# EAGLE design ODB2 (EAGLE 9.2.2)
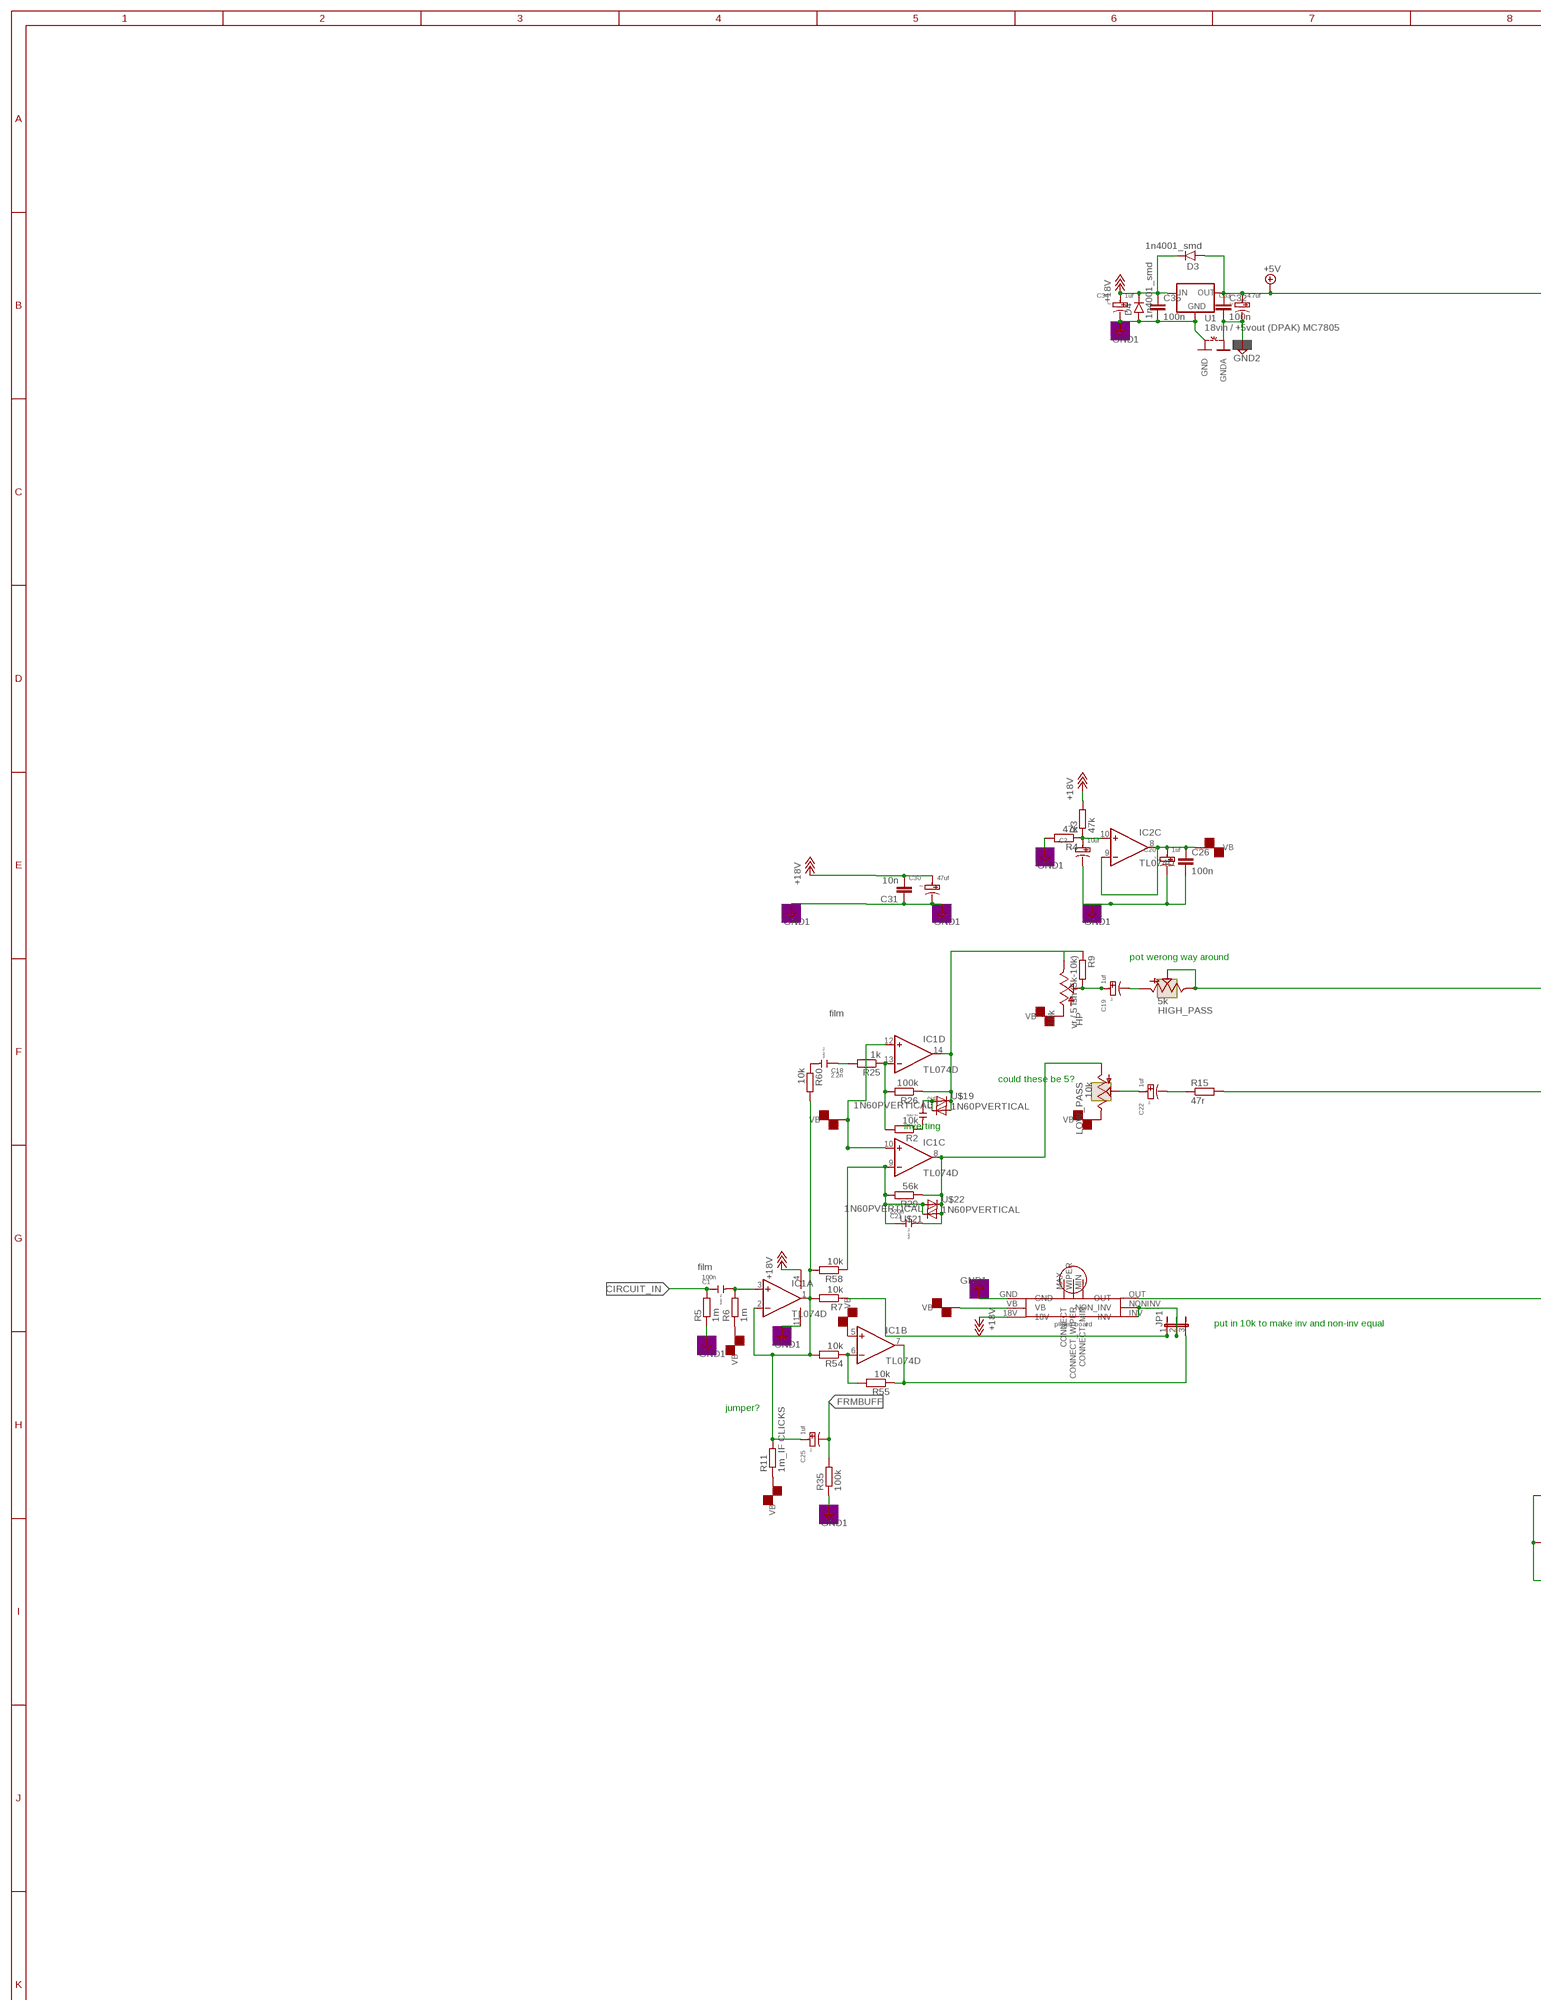
[diagram p0: schematic, sheet 1, part 1 of 3]
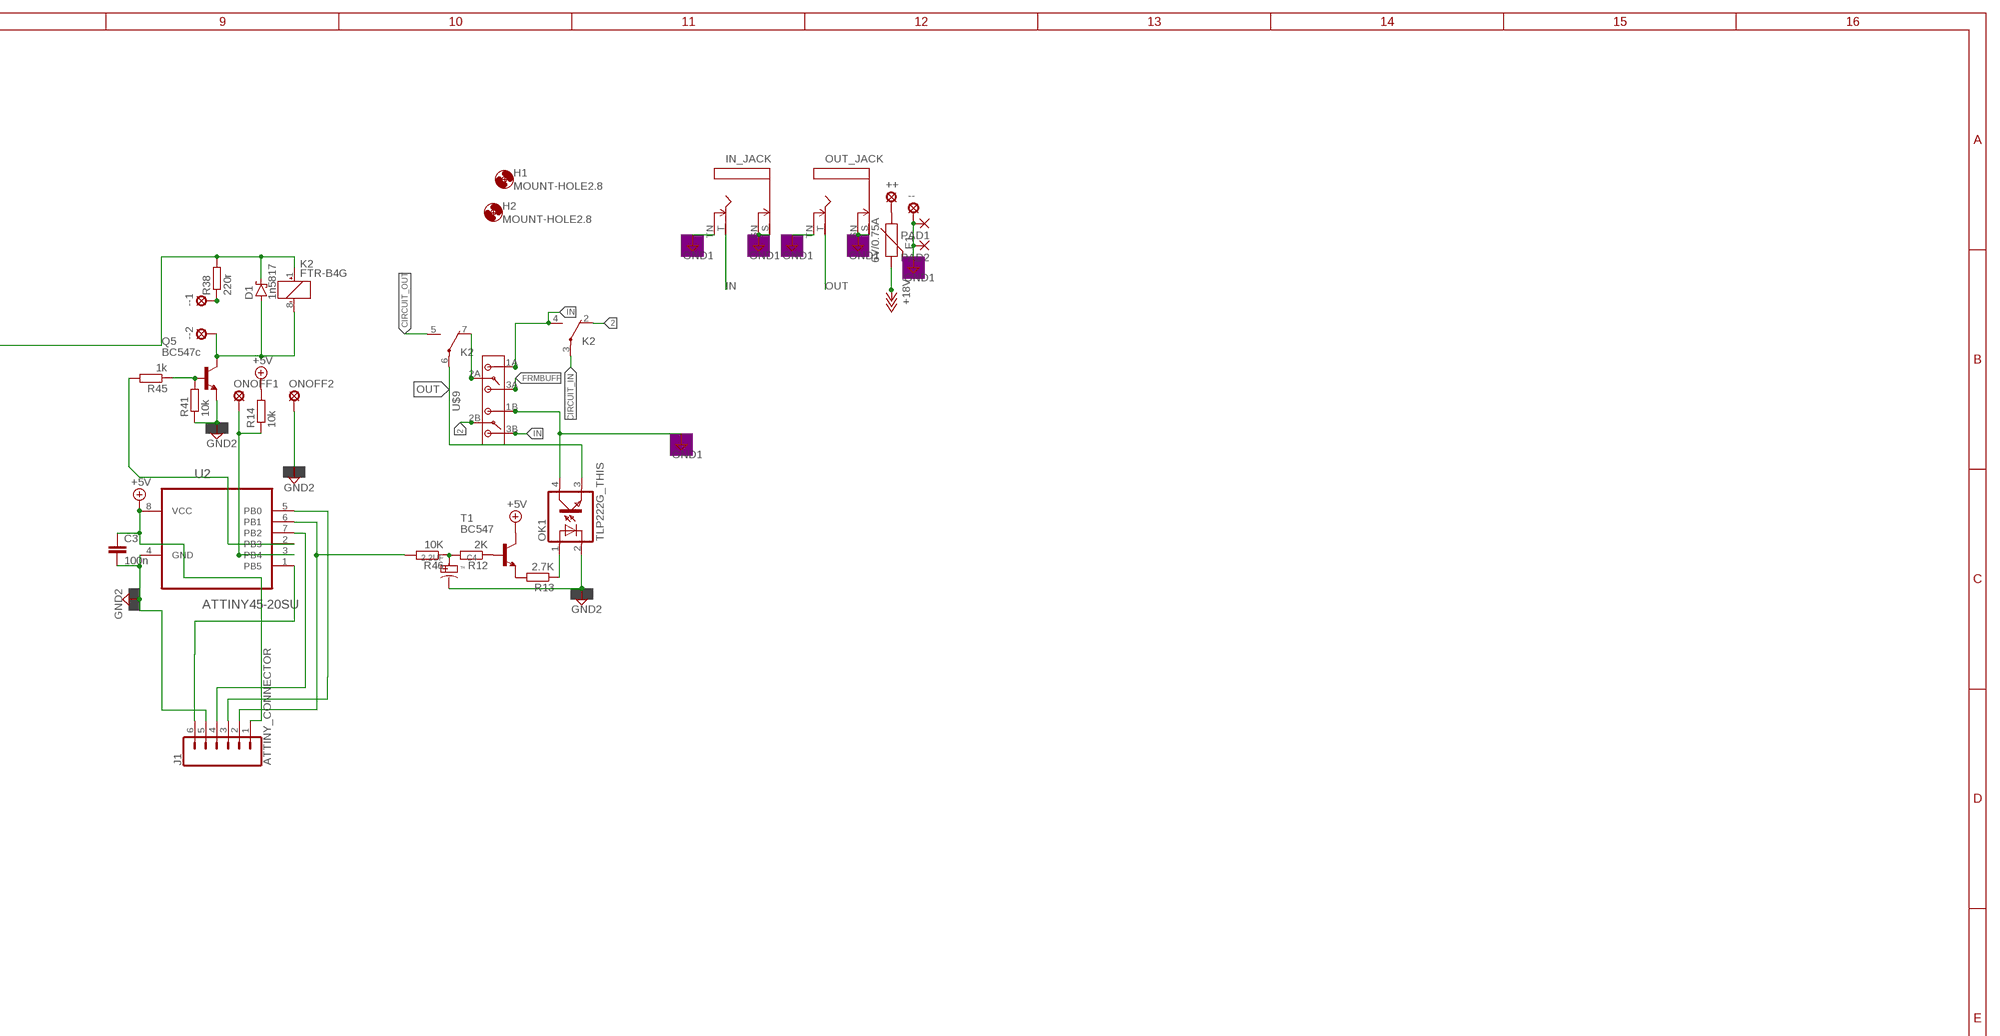
[diagram p1: schematic, sheet 1, part 2 of 3]
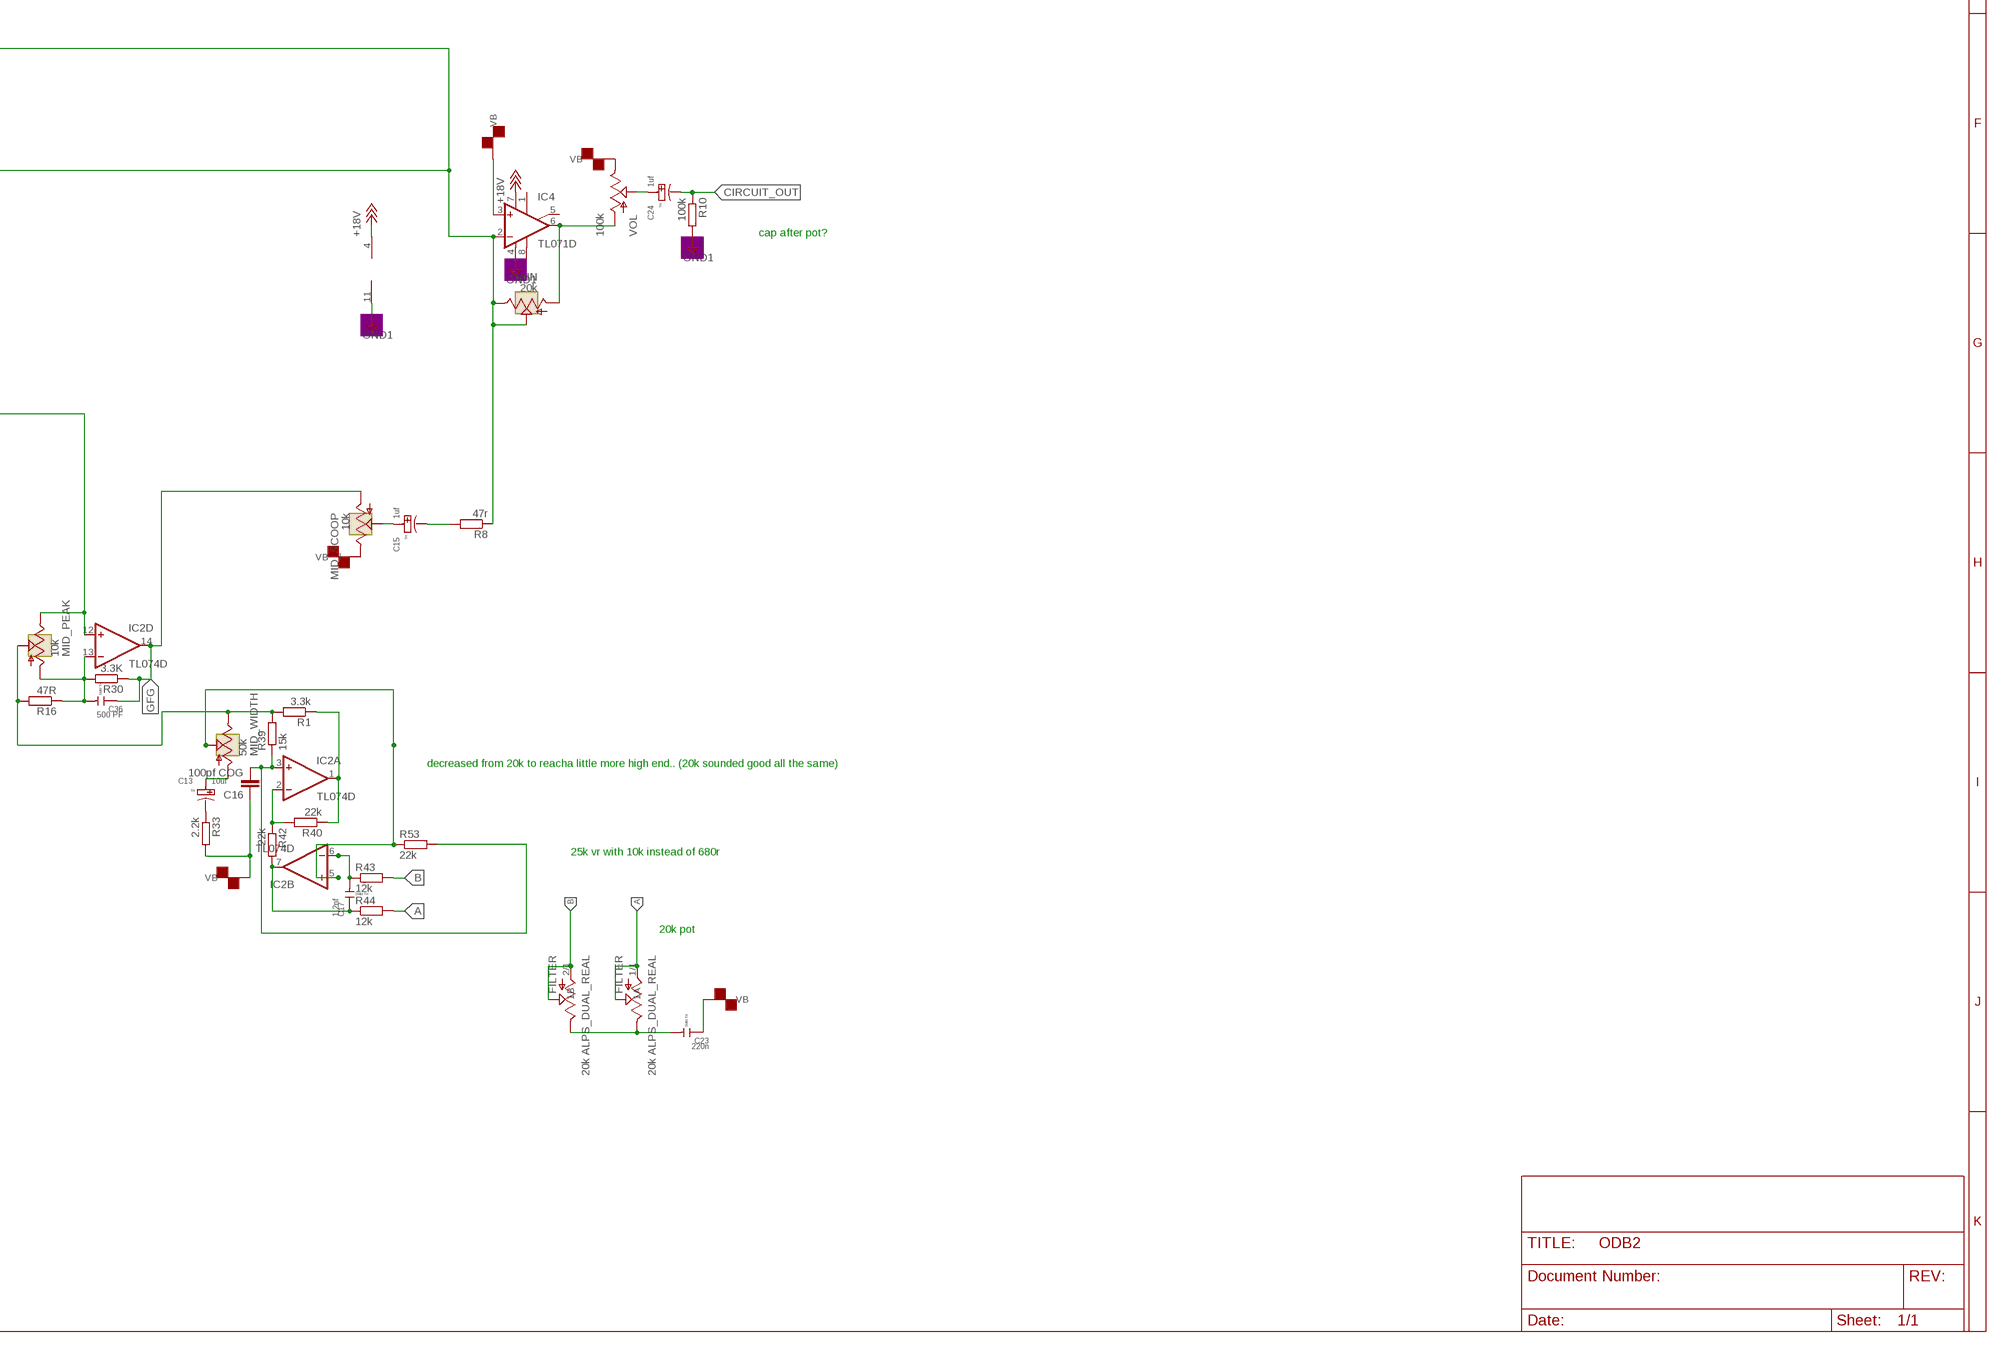
[diagram p2: schematic, sheet 1, part 3 of 3]

## Parts
++  LSP10  [LSP10]
--  LSP10  [LSP10]
--1  LSP10  [LSP10]
--2  LSP10  [LSP10]
C1  100n  THRU_HOLE_5MM_SPACING  [CERAMIC-5MM]
C2  10uf  THRU-HOLE-POLARIZED  [PC-D5.3MM]
C3  100n  C-EUC1206  [C1206]
C4  2.2UF  THRU-HOLE-POLARIZED  [PC-D5.3MM]
C12  1n  THRU_HOLE_5MM_SPACING  [CERAMIC-5MM]
C13  10uf  THRU-HOLE-POLARIZED  [PC-D5.3MM]
C15  1uf  THRU-HOLE-POLARIZED  [PC-D5.3MM]
C16  100pf COG  C-EUC1206  [C1206]
C17  1.2nf  THRU_HOLE_5MM_SPACING  [CERAMIC-5MM]
C18  2.2n  THRU_HOLE_5MM_SPACING  [CERAMIC-5MM]
C19  1uf  THRU-HOLE-POLARIZED  [PC-D5.3MM]
C20  1uf  THRU-HOLE-POLARIZED  [PC-D5.3MM]
C21  220n  THRU_HOLE_5MM_SPACING  [CERAMIC-5MM]
C22  1uf  THRU-HOLE-POLARIZED  [PC-D5.3MM]
C23  220n  THRU_HOLE_5MM_SPACING  [CERAMIC-5MM]
C24  1uf  THRU-HOLE-POLARIZED  [PC-D5.3MM]
C25  1uf  THRU-HOLE-POLARIZED  [PC-D5.3MM]
C26  100n  C-EUC1206  [C1206]
C30  47uf  THRU-HOLE-POLARIZED  [PC-D5.3MM]
C31  10n  C-EUC1206  [C1206]
C32  100n  C-EUC1206  [C1206]
C33  4.7uf  THRU-HOLE-POLARIZED  [PC-D5.3MM]
C34  1uf  THRU-HOLE-POLARIZED  [PC-D5.3MM]
C35  100n  C-EUC1206  [C1206]
C36  500 PF  THRU_HOLE_5MM_SPACING  [CERAMIC-5MM]
D1  1n5817  SCHOTTKY-DIODESMD  [SMB]
D3  1n4001_smd  1N400X.1  [DO41-1]
D4  1n4001_smd  1N400X.1  [DO41-1]
F1  6V/0.75A  PPTC_THREE-QUARTER-AMP  [1206]
FILTER  20k ALPS_DUAL_REAL  ALPS_DUAL_REAL  [ALPS_QUAD]
GAIN  20k  TRIM_US-3223G  [3223G]
H1  MOUNT-HOLE2.8  [2,8]
H2  MOUNT-HOLE2.8  [2,8]
HIGH_PASS  5k  TRIM_US-3223G  [3223G]
HP  10k  POT  [ALPS_POT]
IC1  TL074D  [SO14]
IC2  TL074D  [SO14]
IC4  TL071D  [SO08]
IN_JACK  MMMONNNNOHOLES  [MONONOHOLES]
J1  ATTINY_CONNECTOR  CONN_06LONGPADS  [1X06_LONGPADS]
JP1  JP2W  [JP2W]
K2  FTR-B4G  [FTR-B4G]
LOW_PASS  10k  TRIM_US-3223G  [3223G]
MID_PEAK  10k  TRIM_US-3223G  [3223G]
MID_SCOOP  10k  TRIM_US-3223G  [3223G]
MID_WIDTH  50k  TRIM_US-3223G  [3223G]
OK1  TLP222G_THIS  [DIL04]
ONOFF1  LSP10  [LSP10]
ONOFF2  LSP10  [LSP10]
OUT_JACK  MMMONNNNOHOLES  [MONONOHOLES]
PAD1  SMD5  [SMD2,54-5,08]
PAD2  SMD5  [SMD2,54-5,08]
Q5  BC547c  BC547  [TO92]
R1  3.3k  R-EU_R1206  [R1206]
R2  10k  R-EU_R1206  [R1206]
R3  47k  R-EU_R1206  [R1206]
R4  47k  R-EU_R1206  [R1206]
R5  1m  R-EU_R1206  [R1206]
R6  1m  R-EU_R1206  [R1206]
R7  10k  R-EU_R1206  [R1206]
R8  47r  R-EU_R1206  [R1206]
R9  vr / 5 ish (5k-10k)  R-EU_R1206  [R1206]
R10  100k  R-EU_R1206  [R1206]
R11  1m_IF CLICKS  R-EU_R1206  [R1206]
R12  2K  R-EU_M1206  [M1206]
R13  2.7K  R-EU_M1206  [M1206]
R14  10k  R-EU_M1206  [M1206]
R15  47r  R-EU_R1206  [R1206]
R16  47R  R-EU_R1206  [R1206]
R25  1k  R-EU_R1206  [R1206]
R26  100k  R-EU_R1206  [R1206]
R29  56k  R-EU_R1206  [R1206]
R30  3.3K  R-EU_R1206  [R1206]
R33  2.2k  R-EU_R1206  [R1206]
R35  100k  R-EU_R1206  [R1206]
R38  220r  R-EU_M1206  [M1206]
R39  15k  R-EU_R1206  [R1206]
R40  22k  R-EU_R1206  [R1206]
R41  10k  R-EU_M1206  [M1206]
R42  22k  R-EU_R1206  [R1206]
R43  12k  R-EU_R1206  [R1206]
R44  12k  R-EU_R1206  [R1206]
R45  1k  R-EU_M1206  [M1206]
R46  10K  R-EU_M1206  [M1206]
R53  22k  R-EU_R1206  [R1206]
R54  10k  R-EU_R1206  [R1206]
R55  10k  R-EU_R1206  [R1206]
R58  10k  R-EU_R1206  [R1206]
R60  10k  R-EU_R1206  [R1206]
T1  BC547  [TO92]
U1  18vin / +5vout (DPAK) MC7805  V_REG_78XX7812  [TO-252]
U2  ATTINY45-20SU  [SOIC127P798X216-8N]
U$5  GT_PLUGIN_ODB  [PLUGIN_RECIEVE_ANOTHER]
U$9  BYSWITCH  [BUFF/TRBYPASS]
U$19  1N60PVERTICAL  [DO41-1]
U$20  1N60PVERTICAL  [DO41-1]
U$21  1N60PVERTICAL  [DO41-1]
U$22  1N60PVERTICAL  [DO41-1]
VOL  100k  POT  [ALPS_POT]
~NUDEV~1  GND-GNDA1,27MM  [GND-GNDA-1,27MM]

## Nets
2: K2.2(-1:O) U$9.2B
+5V: C3.1 C32.1 C33.+ D1.C D3.A J1.1 K2.1(K:+) R14.2 R38.2 T1.3(C) U1.2(OUT) U2.8(VCC)
+18V: C30.+ C31.2 C34.+ C35.1 D3.C D4.C F1.2 IC1.4(P:V+) IC2.4(P:V+) IC4.7(V+) R3.2 U1.1(IN) U$5.18V
A: FILTER.1/1(1A) FILTER.1/2(2A) R44.2
B: FILTER.2/1(1B) FILTER.2/2(2B) R43.2
CIRCUIT_IN: C1.1 K2.3(-1:P) R5.2
CIRCUIT_OUT: C24.- K2.5(-2:S) R10.1
FRMBUFF: C25.- R35.2 U$9.3A
GFG: C36.1 IC2.14(D:OUT) MID_SCOOP.1(A) R30.1
GND1: --.MP C2.- C20.- C26.2 C30.- C31.1 C34.- C35.2 D4.A IC1.11(P:V-) IC2.11(P:V-) IC4.4(V-) IN_JACK.S IN_JACK.SN IN_JACK.TN OK1.4(COL) OUT_JACK.S OUT_JACK.SN OUT_JACK.TN PAD1.1(P) PAD2.1(P) R4.2 R5.1 R10.2 R35.1 U1.3(GND) U$5.GND U$9.1B ~NUDEV~1.GND
GND2: C3.2 C4.- C32.2 C33.- J1.5 OK1.2(C) ONOFF2.MP Q5.1(E) R41.1 U2.4(GND) ~NUDEV~1.GNDA
IN: IN_JACK.T K2.4(-1:S) U$9.1A U$9.3B
N$1: C4.+ R12.2 R46.1
N$2: R12.1 T1.2(B)
N$3: C2.+ IC2.10(C:+IN) R3.1 R4.1
N$4: R13.2 T1.1(E)
N$5: C1.2 IC1.3(A:+IN) R6.2
N$6: JP1.1 R7.1
N$7: C15.+ MID_SCOOP.2(S)
N$8: C22.+ LOW_PASS.2(S)
N$9: ++.MP F1.1
N$10: C22.- R15.1
N$11: C12.1 U$19.A U$20.C
N$12: C19.- HIGH_PASS.1(A)
N$13: C15.- R8.2
N$14: JP1.2 U$5.INV U$5.NONINV(NON_INV)
N$15: C24.+ VOL.P$2(S)
N$16: IC1.7(B:OUT) JP1.3 R55.1
N$20: C12.2 R2.1
N$22: C25.+ IC1.1(A:OUT) IC1.2(A:-IN) R7.2 R11.2 R54.2 R58.2 R60.2
N$32: C36.2 IC2.13(D:-IN) MID_PEAK.1(A) R16.1 R30.2
N$33: HP.P$1(E) IC1.14(D:OUT) R9.1 R26.1 U$19.C U$20.A
N$34: MID_PEAK.2(S) MID_WIDTH.3(E) R1.2 R16.2 R39.2
N$35: C19.+ HP.P$2(S) R9.2
N$36: C18.2 R60.1
N$37: C13.+ MID_WIDTH.1(A)
N$38: C13.- R33.1
N$39: C16.2 IC2.3(A:+IN) R39.1 R53.2
N$40: IC2.5(B:+IN) MID_WIDTH.2(S) R53.1
N$41: C18.1 R25.2
N$42: C23.2 FILTER.1/3(3A) FILTER.2/3(3B)
N$43: IC1.13(D:-IN) R2.2 R25.1 R26.2
N$48: IC2.1(A:OUT) R1.1 R40.1
N$49: C17.1 IC2.7(B:OUT) R42.2 R44.1
N$50: IC2.2(A:-IN) R40.2 R42.1
N$53: C17.2 IC2.6(B:-IN) R43.1
N$54: C21.2 IC1.8(C:OUT) LOW_PASS.1(A) R29.1 U$21.A U$22.C
N$58: GAIN.2(S) GAIN.3(E) HIGH_PASS.2(S) HIGH_PASS.3(E) IC4.2(-IN) R8.1 R15.2
N$59: K2.7(-2:O) U$9.2A
N$60: C21.1 IC1.9(C:-IN) R29.2 R58.1 U$21.C U$22.A
N$62: GAIN.1(A) IC4.6(OUT) VOL.P$3(A)
N$74: J1.3 U2.5(PB0)
N$75: J1.2 R46.2 U2.6(PB1)
N$76: J1.4 U2.7(PB2)
N$77: J1.6 U2.1(PB5)
N$78: --1.MP R38.1
N$79: --2.MP D1.A K2.8(K:-) Q5.3(C)
N$80: IC2.12(D:+IN) MID_PEAK.3(E) U$5.OUT
N$82: IC1.6(B:-IN) R54.1 R55.2
N$84: Q5.2(B) R41.2 R45.1
N$85: R45.2 U2.2(PB3)
N$87: ONOFF1.MP R14.1 U2.3(PB4)
N$88: OK1.1(A) R13.1
OUT: K2.6(-2:P) OK1.3(EMIT) OUT_JACK.T
VB: C16.1 C20.+ C23.1 C26.1 HP.P$3(A) IC1.5(B:+IN) IC1.10(C:+IN) IC1.12(D:+IN) IC2.8(C:OUT) IC2.9(C:-IN) IC4.3(+IN) LOW_PASS.3(E) MID_SCOOP.3(E) R6.1 R11.1 R33.2 U$5.VB VOL.P$1(E)
Unconnected: IC4.1(ON1) IC4.5(ON2) IC4.8(OPT) U$5.MAX(CONNECT) U$5.MIN(CONNECT_MIN) U$5.WIPER(CONNECT_WIPER)

## Notes on the sheet
- pot werong way around
- film
- could these be 5?
- inverting
- cap after pot?
- film
- put in 10k to make inv and non-inv equal
- jumper?
- decreased from 20k to reacha little more high end.. (20k sounded good all the same)
- 25k vr with 10k instead of 680r
- 20k pot

## Library data of the parts
++ -- --1 --2 ONOFF1 ONOFF2 = solpad:LSP10: SOLDER PAD drill 1.0 mm, distributor Buerklin, 12H555
C1 C12 C17 C18 C21 C23 C36 = GT_Capacitor:THRU_HOLE_5MM_SPACING: 302010202; PACKAGE: 5MM TH
C2 C4 C13 C15 C19 C20 C22 C24 C25 C30 C33 C34 = GT_Capacitor:THRU-HOLE-POLARIZED: 302030033; PACKAGE: TH
C3 C16 C26 C31 C32 C35 = resistor:C-EU: CAPACITOR, European symbol
D1 = diode:SCHOTTKY-DIODE: Schottky Diode
D3 D4 = gm-diodes:1N400X: Rectifier Diodes often used in power supply to prevent damage from reverse polarization
F1 = GOLDTOOTH-Fuses:PPTC: Resettable Fuse PPTC Resettable Fuse. Really a sort of resistor with a polymeric positive temperature coefficient whose resistance increases dramatically with an increase in temperature. When heated by the power passing through the resistance rises causing the current to be limited, protecting the circuit. This is achieved by the transition of the polymer from a crystalline to an amorphous state where the conductive carbon separates breaking the conductive pathways found in the cool crystalline structure. When a PPTC cools back down it resumes conducting letting the circuit turn back on. SparkFun Products: SparkFun RedBoard - Programmed with Arduino <https://www.sparkfun.com/products/12757> Pro Micro - 5V/16MHz <https://www.sparkfun.com/products/12640> Arduino Pro 328 - 5V/16MHz <https://www.sparkfun.com/products/10915> MP3 Trigger <https://www.sparkfun.com/products/13720>; PROD_ID: RES-11150
FILTER = GOLD_QUAD:ALPS_DUAL_REAL
GAIN HIGH_PASS LOW_PASS MID_PEAK MID_SCOOP MID_WIDTH = pot:TRIM_US-: POTENTIOMETER
H1 H2 = holes:MOUNT-HOLE: MOUNTING HOLE with drill center marker
HP VOL = SparkFun-Electromechanical:POT
IC1 IC2 = linear:TL074: OP AMP
IC4 = linear:TL071: OP AMP
IN_JACK OUT_JACK = gm-jacks2:MMMONNN
J1 = GT_Connectors:CONN_06: Multi connection point. Often used as Generic Header-pin footprint for 0.1 inch spaced/style header connections On any of the 0.1 inch spaced packages, you can populate with these: Break Away Headers - Straight <https://www.sparkfun.com/products/116> (PRT-00116) Break Away Male Headers - Right Angle <https://www.sparkfun.com/products/553> (PRT-00553) Female Headers <https://www.sparkfun.com/products/115> (PRT-00115) Break Away Headers - Machine Pin <https://www.sparkfun.com/products/117> (PRT-00117) Break Away Female Headers - Swiss Machine Pin <https://www.sparkfun.com/products/743> (PRT-00743) Arduino Stackable Header - 6 Pin <https://www.sparkfun.com/products/9280> (PRT-09280) For SCREWTERMINALS and SPRING TERMINALS visit here: Screw Terimnals on SparkFun.com <https://www.sparkfun.com/search/results?term=Screw+Terminals> (5mm/3.5mm/2.54mm spacing) This device is also useful as a general connection point to wire up your design to another part of your project. Our various solder wires solder well into these plated through hole pads. Hook-Up Wire - Assortment (Stranded, 22 AWG) <https://www.sparkfun.com/products/11375> (PRT-11375) Hook-Up Wire - Assortment (Solid Core, 22 AWG) <https://www.sparkfun.com/products/11367> (PRT-11367) View the entire wire category on our website here <https://www.sparkfun.com/categories/141>
JP1 = jumper:JP2W: JUMPER
K2 = relay:FTR-B4: ULTRA MINIATURE RELAY 2 POLES - 2 A (Slim Profile Signal Relay) FUJITSU FTR-B4 SERIES Source: FTR-B4.pdf
OK1 = GT_optocoupler:TLP222G_THIS: SIEMENS OPTO COUPLER; OC_FARNELL: unknown; OC_NEWARK: unknown
PAD1 PAD2 = wirepad:SMD5: SMD PAD
Q5 = transistor-npn:BC547*: NPN Transistor
R1-R16 R25 R26 R29 R30 R33 R35 R38-R46 R53-R55 R58 R60 = resistor:R-EU_: RESISTOR, European symbol
T1 = transistor:BC547: NPN TRANSISTOR
U1 = SparkFun-IC-Power:V_REG_78XX: Voltage Regulator Standard 78xx regulator. IGO (Input Ground Output). Spark Fun Electronics SKU : COM-00107; PROD_ID: VREG-12370; VALUE: +12v
U2 = Atmel_By_element14_Batch_1-00:ATTINY45-20SU: 8-bit Microcontroller with 4 Bytes In-System Programmable Flash; MPN: ATTINY45-20SU; OC_FARNELL: 1288353; OC_NEWARK: 23M5073; PACKAGE: SOIC-8; SUPPLIER: Atmel
U$5 = BluePill:GT_PLUGIN_ODB
U$9 = switch-dil:BYSWITCH
U$19-U$22 = diode:1N60P
~NUDEV~1 = ground-junctions:GND-GNDA: Connect GND - GNDA without DRC-Error, display layer 53 (54) to make copper (ROUTE) from GND to GNDA Select also layer 53 (54) in CAM-Job!

## Net classes
0 default: clearance 0.205 mm

## Board
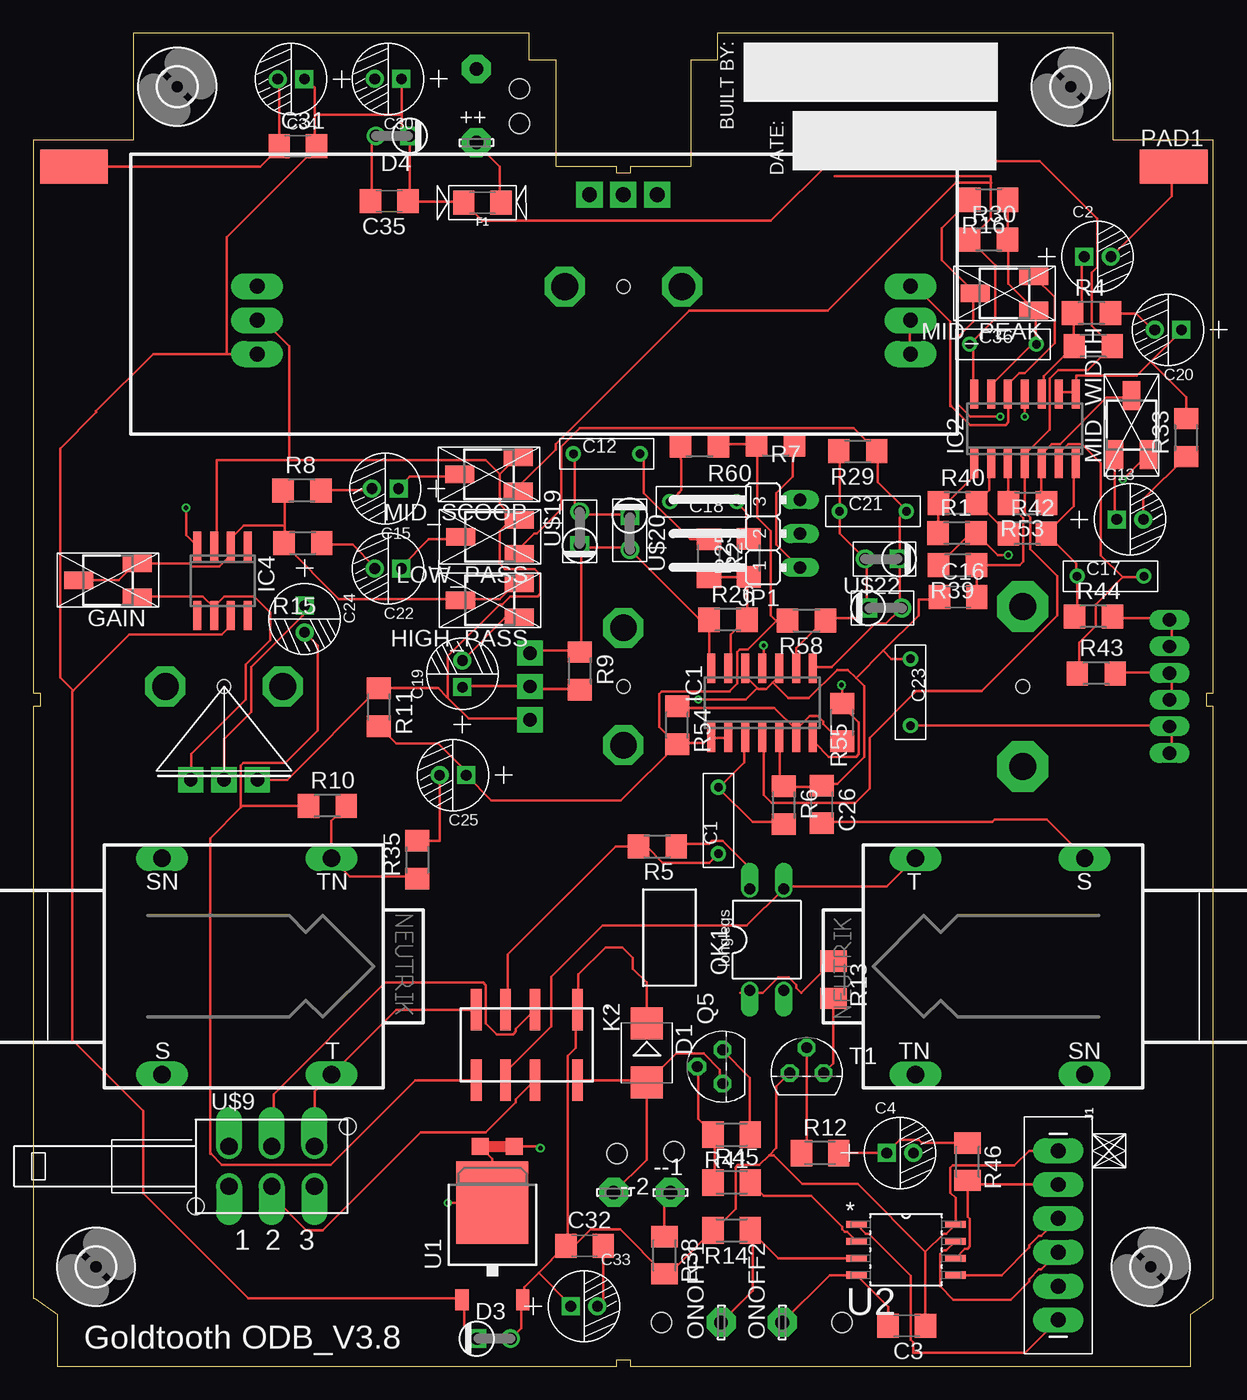
[diagram p3: board, top side]
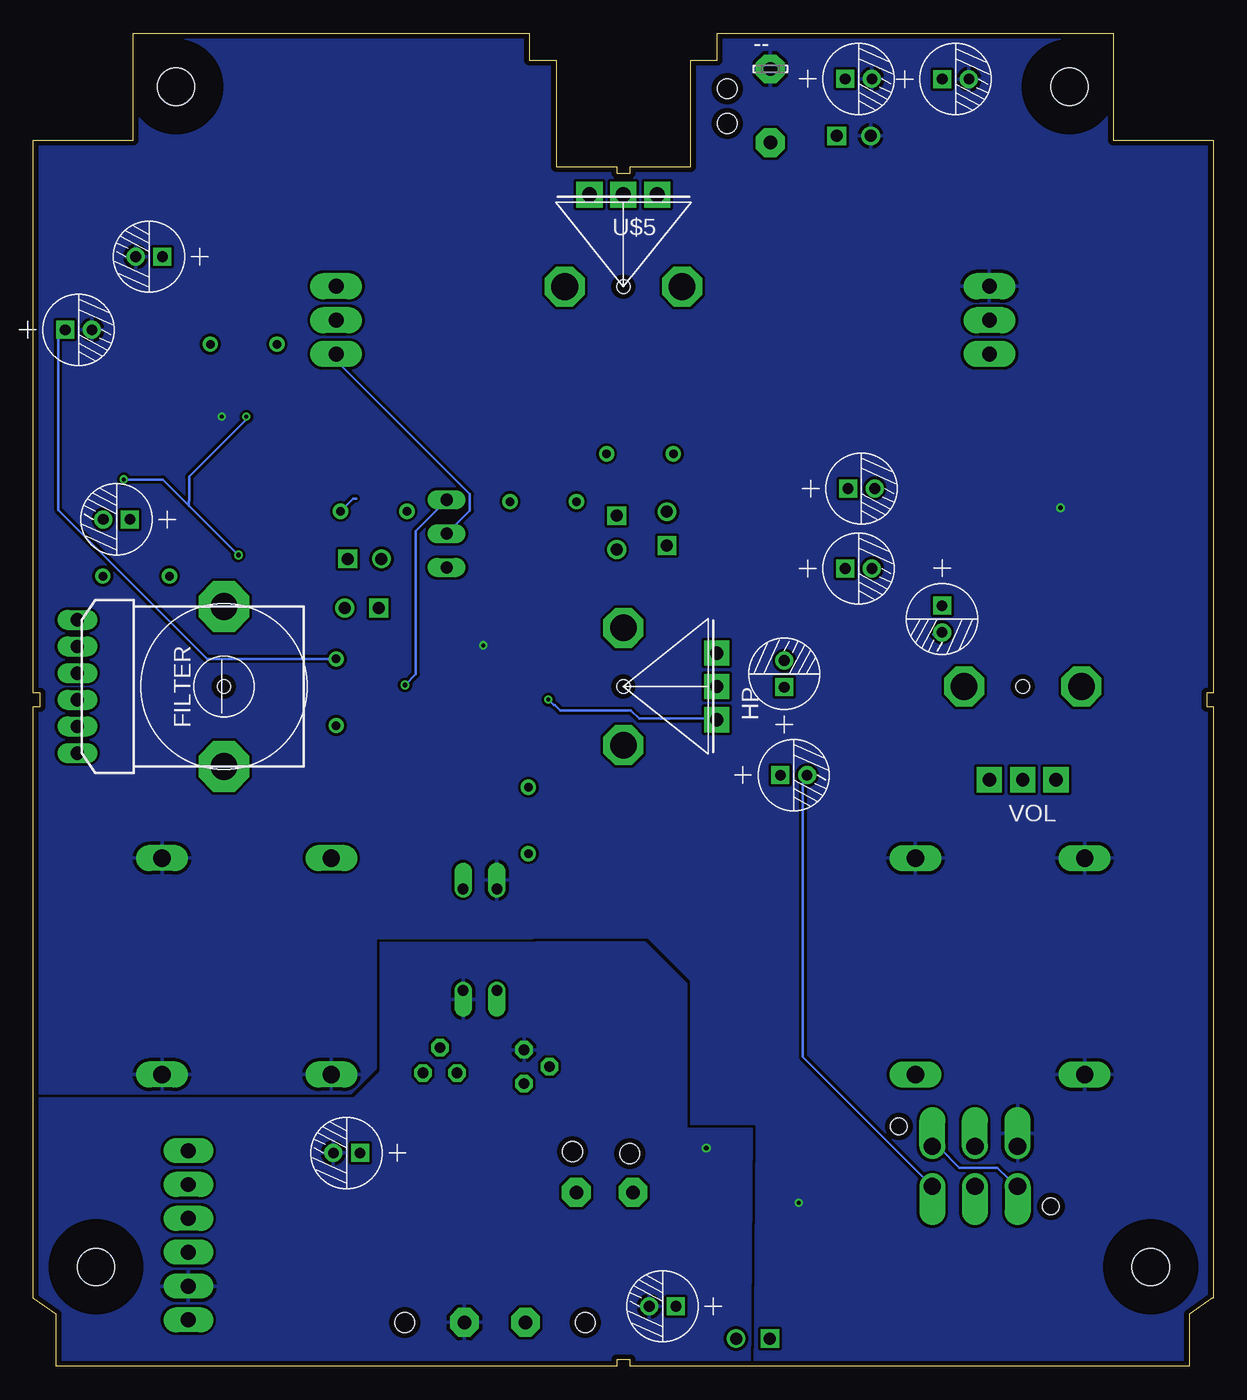
[diagram p4: board, bottom side, seen from below]

Size 88.5 x 100 mm. Coordinates in mm from the lower left corner, seen from the top.
Outline: 88.5,92 81,92 81,100 51.3,100 51.3,98 49.3,98 49.3,90 44.75,90 44.75,89.5 43.75,89.5 43.75,90 39.2,90 39.2,98 37.2,98 37.2,100 7.5,100 7.5,92 0,92 0,50.5 0.5,50.5 0.5,49.5 0,49.5 0,5.08 0.11,5.08 1.8,3.89 1.8,0 43.75,0 43.75,0.5 44.75,0.5 44.75,0 86.8,0 86.8,3.89 88.5,5.08 88.5,49.5 88,49.5 88,50.5 88.49,50.5 88.5,50.51 88.5,92
Copper layers (1*16): Top 0.035mm / dielectric 1.5mm / Bottom 0.035mm
Design rules "GT *": minimum track width 8mil, minimum drill 0.3mm, track to track 8mil, track to pad 6mil, pad to pad 6mil, via to via 6mil, smd to smd 0mil, copper to edge 0.4mm, drill to drill 10mil, minimum pad ring 10mil, minimum via ring 6mil, stop-mask expansion 2mil, vias tented up to drill 25mil, thermal gap 10mil

### Footprints (pad centres in the part's own frame; a part is rotated, then mirrored left to right if it is on the bottom)
LSP10 = drill 1.016 pad 2.159 octagon: MP 0,0
CERAMIC-5MM = drill 0.635 pad 1.143: 1 -2.5,0; 2 2.5,0
PC-D5.3MM = drill 0.8 pad 1.35 square: + -1,0 | drill 0.8 pad 1.35: - 1,0
C1206 = smd 1.6 x 1.8: 1 -1.4,0; 2 1.4,0
SMB = smd 2.4 x 2.4: A 2.2,0; C -2.2,0
DO41-1 = drill 0.9: A 1.27,0 | drill 0.9 square: C -1.27,0
1206 = smd 1.6 x 1.8: 1 -1.4,0; 2 1.4,0
ALPS_QUAD = drill 1 long: 1/1 -3,-11; 1/2 -5,-11; 1/3 5,-11; 2/1 -1,-11; 2/2 1,-11; 2/3 3,-11 | drill 2 pad 3.81 octagon: GND@1 -6,0; GND@2 6,0 | hole 1: 0,0
3223G = smd 2.184 x 1.321: 1 -2.2,1.273; 2 2.2,0; 3 -2.2,-1.273
2,8 = hole 2.8: 0,0
ALPS_POT = drill 1 pad 1.88 square: P$1 7,-2.5; P$2 7,0; P$3 7,2.5 | drill 2 octagon: P$4 0,-4.4; P$5 0,4.4 | hole 1: 0,0
SO14 = smd 0.6 x 2.2: 1 -3.81,-2.6; 2 -2.54,-2.6; 3 -1.27,-2.6; 4 0,-2.6; 5 1.27,-2.6; 6 2.54,-2.6; 7 3.81,-2.6; 8 3.81,2.6; 9 2.54,2.6; 10 1.27,2.6; 11 0,2.6; 12 -1.27,2.6; 13 -2.54,2.6; 14 -3.81,2.6
SO08 = smd 0.6 x 2.2: 1 -1.905,-2.6; 2 -0.635,-2.6; 3 0.635,-2.6; 4 1.905,-2.6; 5 1.905,2.6; 6 0.635,2.6; 7 -0.635,2.6; 8 -1.905,2.6
MONONOHOLES = drill 1.3 long: S 6.35,8.115; SN 6.35,-8.115; T -6.35,8.115; TN -6.35,-8.115
1X06_LONGPADS = drill 1.118 pad 1.88 long: 1 0,0; 2 2.54,0; 3 5.08,0; 4 7.62,0; 5 10.16,0; 6 12.7,0
JP2W = drill 0.914 long: 1 -2.54,-1.27; 2 0,-1.27; 3 2.54,-1.27
FTR-B4G = smd 0.8 x 3.1: 1 -3.8,-2.65; 2 -0.6,-2.65; 3 1.6,-2.65; 4 3.8,-2.65; 5 3.8,2.65; 6 1.6,2.65; 7 -0.6,2.65; 8 -3.8,2.65
DIL04 = drill 0.813 offset: 1 -1.27,-3.81; 2 1.27,-3.81; 3 1.27,3.81; 4 -1.27,3.81
SMD2,54-5,08 = smd 2.54 x 5.08: 1 0,0
TO92 = drill 0.813 octagon: 1 1.27,0; 2 0,1.905; 3 -1.27,0
R1206 = smd 1.6 x 1.803: 1 -1.422,0; 2 1.422,0
M1206 = smd 1.6 x 2: 1 -1.4,0; 2 1.4,0
TO-252 = smd 1 x 1.6: 1 -2.28,-4.8; 2 2.28,-4.8 | smd 5.4 x 6.2: 3 0,2.5
SOIC127P798X216-8N = smd 1.549 x 0.533: 1 -3.708,1.905; 2 -3.708,0.635; 3 -3.708,-0.635; 4 -3.708,-1.905; 5 3.708,-1.905; 6 3.708,-0.635; 7 3.708,0.635; 8 3.708,1.905
HOLD = hole 1.5: 0,0
PLUGIN_RECIEVE_ANOTHER = drill 1.118 pad 1.956 long: 18V -27.46,-5.063; GND -27.46,0.017; INV 21.54,-5.063; NONINV 21.54,-2.523; OUT 21.54,0.017; VB -27.46,-2.523 | drill 1.118 pad 1.956 square: MAX -2.54,6.909; MIN 2.54,6.909; WIPER 0,6.909 | drill 2 octagon: P$4 4.4,0; P$5 -4.4,0 | hole 1: 0,0
BUFF/TRBYPASS = drill 1.3 offset: 1A -3.2,-1.5; 1B -3.2,1.5; 2A 0,-1.5; 2B 0,1.5; 3A 3.2,-1.5; 3B 3.2,1.5 | hole 1.25: -5.7,-3; 5.7,3
GND-GNDA-1,27MM = smd 1.27 x 1.27: GND -1.27,0; GNDA 1.27,0

### Placement (x,y rotation side)
++  33.23,91.8 0 top
--  33.23,97.33 0 bottom
--1  47.78,13.03 0 top
--2  43.53,13.04 0 top
C1  51.37,40.95 90 top
C2  79.82,83.24 0 top
C3  65.51,3.03 180 top
C4  65,16 0 top
C12  43,68.46 0 top
C13  82.26,63.53 0 top
C15  26.39,65.85 180 top
C16  69.36,57.7 0 top
C17  80.79,59.27 0 top
C18  50.26,64.86 180 top
C19  32.18,51.94 90 top
C20  85.11,77.76 180 top
C21  62.97,64.14 0 top
C22  26.61,59.85 180 top
C23  65.79,50.56 270 top
C24  20.34,56.06 270 top
C25  31.47,44.34 180 top
C26  59.14,42.15 270 top
C30  26.6,96.58 180 top
C31  19.84,91.54 0 top
C32  41.35,9.05 0 top
C33  41.31,4.5 0 top
C34  19.33,96.57 180 top
C35  26.69,87.41 180 top
C36  72.73,76.68 0 top
D1  46.02,23.51 270 top
D3  34.53,2.07 0 top
D4  26.97,92.3 180 top
F1  33.68,87.3 180 top
FILTER  74.2,51 270 bottom
GAIN  5.6,58.97 180 top
H1  10.8,96 0 top
H2  77.8,96 0 top
H3  MOUNT-HOLE2.8  [2,8]  4.7,7.45 0 top
H4  MOUNT-HOLE2.8  [2,8]  83.8,7.45 0 top
HIGH_PASS  34.24,57.46 180 top
HP  44.25,51 180 top
IC1  54.66,49.77 0 top
IC2  74.37,70.33 0 top
IC4  14.19,58.92 180 top
IN_JACK  16,30 180 top
J1  76.87,16.17 270 top
JP1  56.23,62.46 90 top
K2  37.02,24.11 180 top
LOW_PASS  34.25,62.23 180 top
MID_PEAK  72.84,80.49 180 top
MID_SCOOP  34.17,66.91 180 top
MID_WIDTH  82.36,70.6 90 top
OK1  55,32 0 top
ONOFF1  51.59,3.29 90 top
ONOFF2  56.17,3.29 90 top
OUT_JACK  72.5,30 0 top
PAD1  85.53,90 270 top
PAD2  3.05,90 90 top
Q5  51.7,22.47 90 top
R1  69.28,62.5 0 top
R2  50.67,60.62 270 top
R3  79.5,76.55 0 top
R4  79.37,79.01 0 top
R5  46.8,39 180 top
R6  56.29,42.08 270 top
R7  55.66,69.14 180 top
R8  20.15,65.69 0 top
R9  41,52.16 270 top
R10  22.05,42.04 0 top
R11  25.91,49.44 270 top
R12  59,16 0 top
R13  60,29 270 top
R14  52.37,10.2 180 top
R15  20.21,61.75 180 top
R16  71.67,87.5 180 top
R25  53.65,60.65 90 top
R26  52.1,56 0 top
R29  61.83,68.64 180 top
R30  71.65,84.51 0 top
R33  86.45,69.67 90 top
R35  28.8,38 90 top
R38  47.33,8.33 270 top
R39  69.32,60.1 180 top
R40  69.31,64.74 0 top
R41  52.37,17.38 180 top
R42  74.55,62.48 0 top
R43  79.72,51.98 0 top
R44  79.51,56.25 0 top
R45  52.37,13.79 0 top
R46  70.07,15.34 270 top
R53  74.56,64.74 180 top
R54  48.28,48.08 270 top
R55  60.66,48.3 270 top
R58  57.98,55.94 180 top
R60  49.97,69.07 0 top
T1  58,22 0 top
U1  34.43,9.78 0 top
U2  65.46,8.74 0 top
U$1  [HOLD]  48.06,16.1 0 top
U$2  [HOLD]  43.77,15.96 0 top
U$5  44.25,81 0 top
U$9  17.88,15 0 top
U$15  [HOLD]  36.45,95.84 0 top
U$16  [HOLD]  36.45,93.24 0 top
U$17  [HOLD]  60.65,3.29 0 top
U$18  [HOLD]  47.11,3.29 0 top
U$19  40.98,62.83 90 top
U$20  44.74,62.53 270 top
U$21  63.87,56.88 0 top
U$22  63.66,60.57 180 top
VOL  14.3,51 270 bottom
~NUDEV~1  34.79,16.49 0 top

### Tracks (layer width: path | path; a pad name or v marks a point on that pad's centre or on a via)
2
  Top 0.203: K2.2 37.62,26.74 36.19,25.31 36.19,25.1 35.99,24.9 34.76,24.9 33.95,25.72 33.95,28.57 33.74,28.78 26.39,28.78 18.03,20.41 18.03,16.53 U$9.2B
+5V
  Top 0.203: D1.C 45.99,25.72 45.99,28.78 44.97,29.8 44.97,30.61 44.15,31.43 42.93,31.43 40.89,29.39 40.89,26.94 K2.1 40.68,26.74 40.68,23.88 40.07,23.27 40.07,9.17 C32.1 | D3.A 35.99,2.25 36.6,2.86 36.6,4.9 U1.2 36.8,5.1 36.8,5.92 37.89,7.01 | 37.89,7.01 39.87,8.98 C32.1 | 76.81,16.33 J1.1 74.69,16.17 73.57,15.05 68.95,15.05 68.77,14.87 68.77,13.02 69.17,12.62 U2.8 68.47,9.95 68.26,9.95 66.91,8.6 | 50.89,10 50.9,10.04 | 50.9,10.04 R14.2 47.7,6.93 R38.2 | 47.38,7.02 R38.2 | C32.1 40.07,8.98 40.55,8.98 41.82,10.25 44.01,10.25 R38.2 | C3.1 66.91,8.6 | T1.3 55.73,21 55.73,16.36 55.18,15.82 | 55.18,15.82 54.46,15.09 52.84,15.09 52.66,14.91 52.66,11.8 50.9,10.04 | 66.91,8.6 61.81,13.69 57.67,13.69 55.55,15.82 55.18,15.82 | 37.89,7.01 40.21,4.69 C33.+
+18V
  Top 0.203: 21.09,93.89 21.09,95.93 20.48,96.54 C34.+ | 21.09,93.89 21.09,91.64 C31.2 21.23,91.44 14.49,84.7 14.49,75.92 | 27.62,93.89 27.62,93.07 28.23,92.46 D4.C 28.23,92.25 28.23,87.56 C35.1 28.23,87.36 32.11,87.36 F1.2 33.66,85.93 55.31,85.93 59.8,90.41 75.49,90.41 79.8,86.1 79.8,82.44 79.39,82.03 79.39,78.07 R3.2 79.1,74.72 76.87,74.72 76.24,74.1 76.24,70.26 74.56,68.58 | 27.62,93.89 27.62,96.54 C30.+ | 27.62,93.89 21.09,93.89 | D3.C 33.13,2.25 32.31,3.06 32.31,4.9 U1.1 32.11,5.1 16.12,5.1 8.25,12.97 8.25,19.16 2.92,24.49 2.92,50.62 2.99,50.69 | 2.99,50.69 7.21,54.9 14.15,54.9 14.76,55.52 14.76,56.13 IC4.7 | 2.99,50.69 2,51.68 2,68.86 4.72,71.59 4.69,71.64 8.98,75.92 14.49,75.92 | IC1.4 54.76,47.07 54.76,42.86 55.38,42.25 61.64,42.25 62.72,43.33 62.72,47.14 66.23,50.65 71.12,50.65 76.81,56.33 76.81,59.26 74.78,61.29 74.78,63.69 74.36,64.1 IC2.4 | 74.56,68.58 74.56,67.76 IC2.4 | 74.56,68.58 IC2.4 | 14.49,75.92 16.74,75.92 U$5.18V
A
  Top 0.203: R44.2 81.09,56.13 85.17,56.13 FILTER.1/2 85.38,55.92 85.38,54.09 FILTER.1/1
B
  Top 0.203: R43.2 81.3,52.05 85.17,52.05 FILTER.2/1 85.38,51.84 85.38,50.01 FILTER.2/2
CIRCUIT_IN
  Top 0.203: C1.1 51.3,38.37 50.68,37.76 47.21,37.76 45.99,38.98 45.58,38.98 R5.2 43.7,39 35.58,30.88 35.58,26.94 K2.3
CIRCUIT_OUT
  Top 0.203: K2.5 33.19,21.43 28.64,21.43 22.31,15.1 14.15,15.1 13.33,15.92 13.27,15.92 13.27,37.35 13.25,37.37 13.25,39.61 15.55,41.91 | C24.- 21.32,54.08 21.32,47.68 18.89,45.25 15.73,45.25 15.55,45.07 15.55,41.91 | R10.1 15.68,42.04 15.55,41.91
  Bottom 0.203: 21.02,54.9 20.41,54.9 C24.-
FRMBUFF
  Top 0.203: C25.- 30.47,39.42 R35.2
  Bottom 0.203: C25.- 30.78,44.03 30.78,23.2 U$9.3A
GFG
  Top 0.203: R30.1 70.24,84.53 | IC2.14 70.48,73.07 70.48,76.33 70.28,76.54 C36.1 | C36.1 70.22,76.69 | C36.1 72.13,78.58 72.13,82.62 R30.1 | 36.45,65.64 MID_SCOOP.1 36.53,65.72 36.53,66.13 39.19,68.78 39.19,69.19 49.19,79.19 59.6,79.19 69.19,88.78 71.8,88.78 | R30.1 71.8,86.08 71.8,88.78 | 71.8,88.78 71.8,89.29 60.11,89.29 | 71.84,88.78 71.8,88.78
GND1  (via drill 0.3, 0.35)
  Top 0.203: 58.44,40.62 59.05,40.62 C26.2 59.26,40.82 71.91,40.82 72.11,41.02 75.99,41.02 78.85,38.17 OUT_JACK.S | R5.1 48.23,39.19 50.68,39.19 50.89,39.39 51.7,39.39 53.73,37.36 OK1.4 | C34.- 18.43,96.54 18.43,91.64 C31.1 18.43,91.44 17.01,90.01 3.13,90.01 PAD2.1 | C35.2 25.37,87.56 25.37,92.05 25.58,92.25 D4.A | R35.1 28.64,36.74 23.74,36.74 22.52,37.96 IN_JACK.TN 22.35,40.92 R10.2 | 12.31,61.64 IC4.4 11.46,62.35 v11.46,64.39 | v54.76,54.09 54.76,52.45 IC1.11 | v31.09,12.25 34.35,12.25 U1.3 34.43,15.57 ~NUDEV~1.GND | R4.2 80.89,78.99 82.73,78.99 83.95,77.76 C20.- | v74.36,71.23 74.36,72.86 IC2.11 | PAD1.1 85.38,89.8 85.38,87.76 80.89,83.27 C2.-
  pour Bottom (rank 5): -3.2,100.97 92.69,100.97 92.69,-4.45 -3.2,-4.45
GND2  (via drill 0.35)
  Top 0.203: 42.74,4.78 C33.- 42.74,4.93 C32.2 | R41.1 53.74,17.55 53.74,21.64 51.7,23.68 Q5.1 | 56.19,3.47 ONOFF2.MP 59.72,6.84 U2.4 64.11,4.47 C3.2 | ~NUDEV~1.GNDA 37.9,16.49 v38.03,16.36
  pour Bottom: 39.5,17.82 39.5,28.7 42.59,31.79 50.79,31.79 62.48,31.75 62.48,22.08 64.47,20.1 92.47,20.1 92.47,-0.85 34.73,-0.85 34.59,17.82
IN
  Top 0.203: K2.4 33.13,26.74 27.21,26.74 22.52,22.04 IN_JACK.T 22.31,21.84 21.09,20.61 21.09,16.53 U$9.3B
  Bottom 0.203: U$9.1A 14.76,13.68 15.17,14.08 15.37,14.08 16.19,14.9 19.05,14.9 20.48,16.33 20.88,16.33 U$9.3B
N$1
  Top 0.203: R12.2 C4.+ 64.98,16.98 66.41,16.98 66.64,16.74 R46.1
N$2
  Top 0.203: R12.1 58,16.4 T1.2
N$3
  Top 0.203: IC2.10 75.79,73.07 75.79,74.29 78.03,76.54 R3.1 78.03,76.74 78.03,78.99 R4.1 78.03,79.19 78.64,79.8 78.64,83.07 C2.+
N$4
  Top 0.203: T1.1 60,22.73 R13.2
N$5
  Top 0.203: R6.2 56.19,40.82 53.95,40.82 51.5,43.27 C1.2 51.5,43.47 53.34,45.31 53.34,47.15 IC1.3
N$6
  Top 0.203: R7.1 56.94,68.99 56.94,66.74 55.72,65.52 55.72,61.64 57.35,60.01 JP1.1
N$7
  Top 0.203: MID_SCOOP.2 31.91,66.74 28.23,66.74 27.41,65.92 C15.+
N$8
  Top 0.203: LOW_PASS.2 31.91,62.05 29.66,62.05 27.62,60.01 C22.+
N$9
  Top 0.203: F1.1 34.97,87.36 34.97,90.01 33.33,91.64 ++.MP
N$10
  Top 0.203: R15.1 21.7,61.64 23.95,61.64 25.58,60.01 C22.-
N$11
  Top 0.203: 40.68,64.5 40.89,64.29 U$19.A | 40.68,68.23 C12.1 40.62,68.17 40.62,64.5 U$19.A | U$20.C 44.56,63.88 41.29,63.88 41.09,64.09 U$19.A
N$12
  Top 0.203: HIGH_PASS.1 36.4,56.13 35.38,56.13 32.31,53.07 C19.-
N$13
  Top 0.203: R8.2 21.7,65.72 25.37,65.72 C15.-
N$14
  Top 0.203: U$5.NONINV 65.72,78.37 65.72,76.13 U$5.INV 65.72,75.92 | 57.55,62.62 JP1.2 57.56,62.66
  Bottom 0.203: 57.5,62.67 JP1.2 55.77,64.19 55.77,65.42 65.79,75.45 U$5.INV
N$15
  Top 0.203: VOL.P$2 14.3,47.06 16.33,49.09 16.33,52.45 20.21,56.33 20.21,56.94 C24.+
N$16  (via drill 0.35)
  Top 0.203: R55.1 60.68,49.6 60.68,49.51 61.91,48.28 61.91,45.92 61.7,45.72 59.66,45.72 58.64,46.74 58.64,47.15 IC1.7 | 60.68,49.8 R55.1 | R55.1 60.66,51.06 v60.62,51.11
  Bottom 0.203: JP1.3 57.5,64.96 59.8,62.66 59.8,51.93 v60.62,51.11
N$20
  Top 0.203: R2.1 50.48,62.05 49.25,62.05 45.78,65.52 45.78,68.35 C12.2
N$22
  Top 0.203: R54.2 48.44,46.74 50.27,46.74 50.68,47.15 IC1.1 50.89,47.15 52.11,47.15 IC1.2 | 56.4,56.13 R58.2 55.76,55.94 55.73,55.91 | 53.95,69.19 54.15,69.19 R7.2 | R54.2 44.07,42.45 34.36,42.45 C25.+ 32.47,44.63 30.38,46.72 27.22,46.72 R11.2 | 55.73,55.91 53.59,53.78 52.97,53.78 52.79,53.6 52.79,51.2 52.2,50.62 | 52.2,50.62 47.15,50.62 46.94,50.41 46.94,47.96 48.17,46.74 R54.2 | 52.2,50.62 52.25,50.62 | R60.2 51.43,69.19 53.88,69.19 R7.2 | 55.73,55.91 55.31,56.33 55.31,62.66 54.29,63.68 54.29,68.99 R7.2
N$32
  Top 0.203: IC2.13 71.91,73.07 71.91,73.68 74.77,76.54 75.17,76.54 C36.2 75.17,76.74 75.17,79.19 MID_PEAK.1 75.04,79.32 73.13,81.23 73.13,84.45 R30.2 73.07,87.48 R16.1
N$33
  Top 0.203: HP.P$1 37.42,53.68 40.89,53.68 R9.1 41.09,53.68 41.09,61.43 | IC1.14 50.68,52.45 50.68,55.92 R26.1 50.48,56.13 49.87,56.13 44.76,61.23 U$20.A 44.56,61.43 41.09,61.43 | 41.09,61.43 U$19.C
N$34  (via drill 0.3, 0.35)
  Top 0.203: v72.52,71.23 70.28,71.23 69.25,72.25 69.25,77.15 70.48,78.37 70.48,80.42 MID_PEAK.2 68.13,83 68.13,85.39 R16.2 | v81.71,66.54 83.54,68.37 MID_WIDTH.3 | R39.2 70.23,62.44 70.21,62.45 70.62,62.45 R1.2 72.34,60.86 v73.12,60.86
  Bottom 0.203: v72.52,71.23 72.52,71.03 76.81,66.74 76.81,64.9 76.84,64.9 76.84,64.58 v73.12,60.86 78.8,66.54 v81.71,66.54
N$35
  Top 0.203: 40.89,50.82 R9.2 40.82,50.82 37.35,50.82 HP.P$2 37.15,51.02 32.25,51.02 C19.+ 32.31,51.02
N$36
  Top 0.203: C18.2 48.39,65.5 | 48.39,65.5 48.48,65.58 | R60.1 48.46,68.99 | R60.1 48.55,68.04 48.58,67.97 48.58,65.72 48.37,65.52 48.39,65.5 | R60.1 48.23,69.38
N$37
  Top 0.203: MID_WIDTH.1 81.09,68.37 81.09,63.68 C13.+
N$38
  Top 0.203: R33.1 83.25,65.05 C13.-
N$39
  Top 0.203: 72.93,67.76 IC2.3 73.13,67.56 R53.2 74.26,63.63 74.26,60.38 73.98,60.1 70.94,60.1 | 70.94,60.1 R39.1 | C16.2 70.76,59.91 70.94,60.1
N$40
  Top 0.203: 75.79,68.58 75.79,67.76 IC2.5 | 75.79,68.58 76.4,69.19 77.01,69.19 80.48,72.66 82.32,72.66 MID_WIDTH.2 | 75.79,68.58 IC2.5 | R53.1 75.58,65.17 75.58,67.56 IC2.5
N$41
  Top 0.203: 53.54,62.25 R25.2 53.47,62.25 53.47,64.09 52.86,64.7 C18.1
N$42
  Top 0.203: FILTER.1/3 85.38,46.13 85.38,47.96 FILTER.2/3 85.38,48.17 85.28,48.06 C23.2
N$43
  Top 0.203: 53.54,59.19 50.68,59.19 R2.2 | 53.54,59.19 53.54,56.13 R26.2 53.34,55.92 52.31,54.9 52.31,52.45 IC1.13 | 53.54,59.19 R25.1
N$48
  Top 0.203: 70.48,66.74 70.48,67.56 IC2.1 70.48,66.74 | 70.48,66.74 68.64,64.9 67.97,64.9 R40.1 67.89,62.53 R1.1
N$49
  Top 0.203: 78.24,56.33 R44.1 78.29,56.46 C17.1 78.24,59.33 78.24,60.22 R42.2 78.03,64.54 78.03,67.56 IC2.7
N$50
  Top 0.203: IC2.2 71.7,67.56 71.7,65.72 70.89,64.9 R40.2 70.89,64.7 70.91,64.7 R42.1
N$53
  Top 0.203: 81.71,59.19 79.67,57.15 79.67,55.52 78.44,54.29 78.44,52.05 R43.1 | 81.71,59.19 83.13,59.19 C17.2 | 81.71,59.19 80.07,60.82 80.07,67.76 78.64,69.19 77.62,69.19 77.01,68.58 77.01,67.76 IC2.6
N$54
  Top 0.203: IC1.8 58.64,52.45 59.87,52.45 63.13,55.72 63.95,55.72 64.97,56.74 U$21.A 64.97,56.94 64.97,60.41 U$22.C 64.97,60.62 64.97,63.68 65.38,64.09 C21.2 65.38,64.29 63.34,66.33 63.34,68.58 | 63.34,68.58 R29.1 | 36.6,61.43 36.6,61.03 LOW_PASS.1 36.53,61.43 37.55,62.45 37.76,62.45 39.59,64.29 39.59,68.99 40.99,70.38 61.53,70.38 63.34,68.58
  Bottom 0.203: 64.29,65.11 64.5,65.11 65.11,64.5 65.31,64.5 65.52,64.29 C21.2
N$58
  Top 0.203: HIGH_PASS.3 36.4,58.58 35.99,58.58 34.97,57.56 32.11,57.56 HIGH_PASS.2 31.91,57.56 22.93,57.56 18.84,61.64 R15.2 18.84,61.84 18.84,63.07 | GAIN.2 3.54,58.98 6.39,58.98 7.62,60.21 GAIN.3 7.82,60.21 11.7,60.21 11.9,60.01 13.94,60.01 14.76,60.82 14.76,61.43 IC4.2 14.96,61.64 14.96,62.25 15.78,63.07 18.84,63.07 | 18.84,63.07 18.84,65.52 R8.1
N$59
  Top 0.203: K2.7 37.62,21.43 36.19,20 36.19,19.8 33.95,17.55 29.05,17.55 21.7,10.21 20.48,10.21 18.03,12.65 18.03,13.47 U$9.2A
N$60
  Top 0.203: R29.2 60.48,68.58 60.48,64.29 C21.1 60.48,64.09 60.48,62.45 62.32,60.62 U$22.A 62.52,60.41 62.52,56.94 U$21.C 62.52,56.74 61.91,56.13 59.46,56.13 R58.1 59.26,55.92 57.21,53.88 57.21,52.45 IC1.9
N$62
  Top 0.203: 13.54,56.94 12.72,57.76 7.82,57.76 GAIN.1 | 13.54,56.94 13.54,56.33 IC4.6 | 13.54,56.94 14.32,57.73 16.56,57.73 17.76,56.54 17.76,54.49 15.92,52.66 15.92,50.01 11.84,45.92 11.84,44.09 VOL.P$3
N$74
  Top 0.203: 76.81,11.02 J1.3 75.58,9.79 75.41,9.79 74.68,9.06 74.68,8.9 72.62,6.84 U2.5
N$75
  Top 0.203: 70.25,13.82 R46.2 | U2.6 69.86,8.8 70.07,8.8 70.25,8.98 70.25,11.04 70.07,11.21 R46.2 | J1.2 70.39,13.63 R46.2
N$76
  Top 0.203: U2.7 68.47,8.68 68.26,8.68 68,8.42 68,6 69,5 73.32,5 74.68,6.36 74.68,6.52 75.41,7.25 75.58,7.25 J1.4
N$77
  Top 0.203: U2.1 62.45,9.95 62.65,9.95 65.81,6.79 65.81,2 66,1.8 66,1 74.4,1 J1.6
N$78
  Top 0.203: R38.1 47.33,12.59 --1.MP
N$79
  Top 0.203: 45.99,21.43 40.89,21.43 K2.8 | 45.99,21.43 D1.A 46.19,21.43 48.23,23.47 50.27,23.47 51.5,22.25 51.5,21.23 Q5.3 | --2.MP 45.99,15.5 45.99,21.43
N$80
  Top 0.203: U$5.OUT 65.92,80.82 66.33,80.82 68.78,78.37 68.78,72.05 68.85,72.05 70.28,70.62 72.93,70.62 73.13,70.82 73.13,72.86 IC2.12 73.13,72.97 73.13,73.68 73.95,74.5 74.36,74.5 76.6,76.74 76.6,80.2 MID_PEAK.3
N$82
  Top 0.203: 57.21,47.76 58.23,48.78 58.85,48.78 59.26,48.37 59.26,48.17 60.48,46.94 R55.2 | 57.21,47.76 57.21,47.35 IC1.6 57.21,47.76 | 57.21,47.76 55.58,49.39 48.44,49.39 R54.1
N$84
  Top 0.203: R45.1 51.09,13.88 51.09,17.35 R41.2 50.89,17.55 49.87,18.57 49.87,22.45 Q5.2
N$85
  Top 0.203: 53.95,13.68 R45.2 54.77,12.79 58.34,12.79 60.67,10.46 60.67,10.25 60.85,10.07 61.05,10.07 U2.2
N$87
  Top 0.203: R14.1 53.95,10.21 53.95,5.65 ONOFF1.MP 51.7,3.47 | 53.74,10 R14.1 | U2.3 55.86,8.11 R14.1
N$88
  Top 0.203: R13.1 57.6,28 57.24,28.36 57.24,28.59 56.67,29.16 55.87,29.16 54.71,28 53.54,28 | 53,28 53.54,28 | 53.54,28 OK1.1
OUT
  Top 0.203: OUT_JACK.T 65.99,37.96 64.01,35.99 56.45,35.99 OK1.3 53.52,33.06 42.69,33.06 38.84,29.22 38.84,25.51 35.58,22.25 35.58,21.64 K2.6
VB  (via drill 0.3)
  Top 0.203: IC4.3 13.74,61.64 13.74,67.97 19.18,67.97 | 35.99,63.68 36.4,63.68 LOW_PASS.3 35.99,63.68 | 35.99,63.68 34.97,64.7 34.97,66.94 | 34.97,66.94 36.19,68.17 MID_SCOOP.3 | 35.99,63.68 34.97,62.66 34.97,60.21 35.38,59.8 37.62,59.8 38.03,59.39 38.03,57.96 37.82,57.76 35.78,57.76 35.17,57.15 34.97,57.15 31.09,53.27 31.09,50.21 31.02,50.21 | 19.18,67.97 33.95,67.97 34.97,66.94 | 53.54,51.64 53.54,52.25 IC1.12 53.54,51.64 | 54.3,50.88 54.36,50.82 54.97,50.82 55.44,51.3 | 54.3,50.88 53.54,51.64 | 55.78,51.64 55.44,51.3 | 55.78,51.64 55.78,52.25 IC1.10 55.78,51.64 | IC1.5 55.99,47.15 55.99,43.88 56.19,43.68 R6.1 56.4,43.47 59.05,43.47 C26.1 59.26,43.68 60.27,43.68 62.32,45.72 62.32,51.02 61.7,51.64 | 55.44,51.3 56.63,50.11 58.14,50.11 60.27,52.25 61.09,52.25 61.7,51.64 | 63.74,53.68 66.4,56.33 66.4,57.51 67.77,57.51 C16.1 | 63.74,53.68 61.7,51.64 | v49.87,50.01 53.42,50.01 54.3,50.88 | 63.74,53.68 64.36,53.06 C23.1 | IC2.9 77.01,73.07 78.03,73.07 IC2.8 78.24,72.99 78.24,74.32 82.75,74.32 83.79,75.36 | R33.2 86.45,72.69 83.79,75.36 | 83.79,75.36 86.11,77.67 C20.+ | 16.94,44.09 VOL.P$1 19.05,44 R11.1 30.37,50.87 31.02,50.21 | 31.02,50.21 32.66,48.58 37.15,48.58 HP.P$3 | 19.18,67.97 19.18,76.54 17.35,78.37 16.94,78.37 U$5.VB
  Bottom 0.203: v49.87,50.01 49.46,49.6 49.39,49.6 48.98,49.19 43.68,49.19 43.06,48.58 37.35,48.58 HP.P$3 | C23.1 75.45,53.06 86.63,64.24 86.63,77.23 C20.+

### Text on the board
tPlace: BUILT BY: | DATE: | GOLDTOOTH ODB V3.3 | longlegs | Goldtooth ODB_V3.8